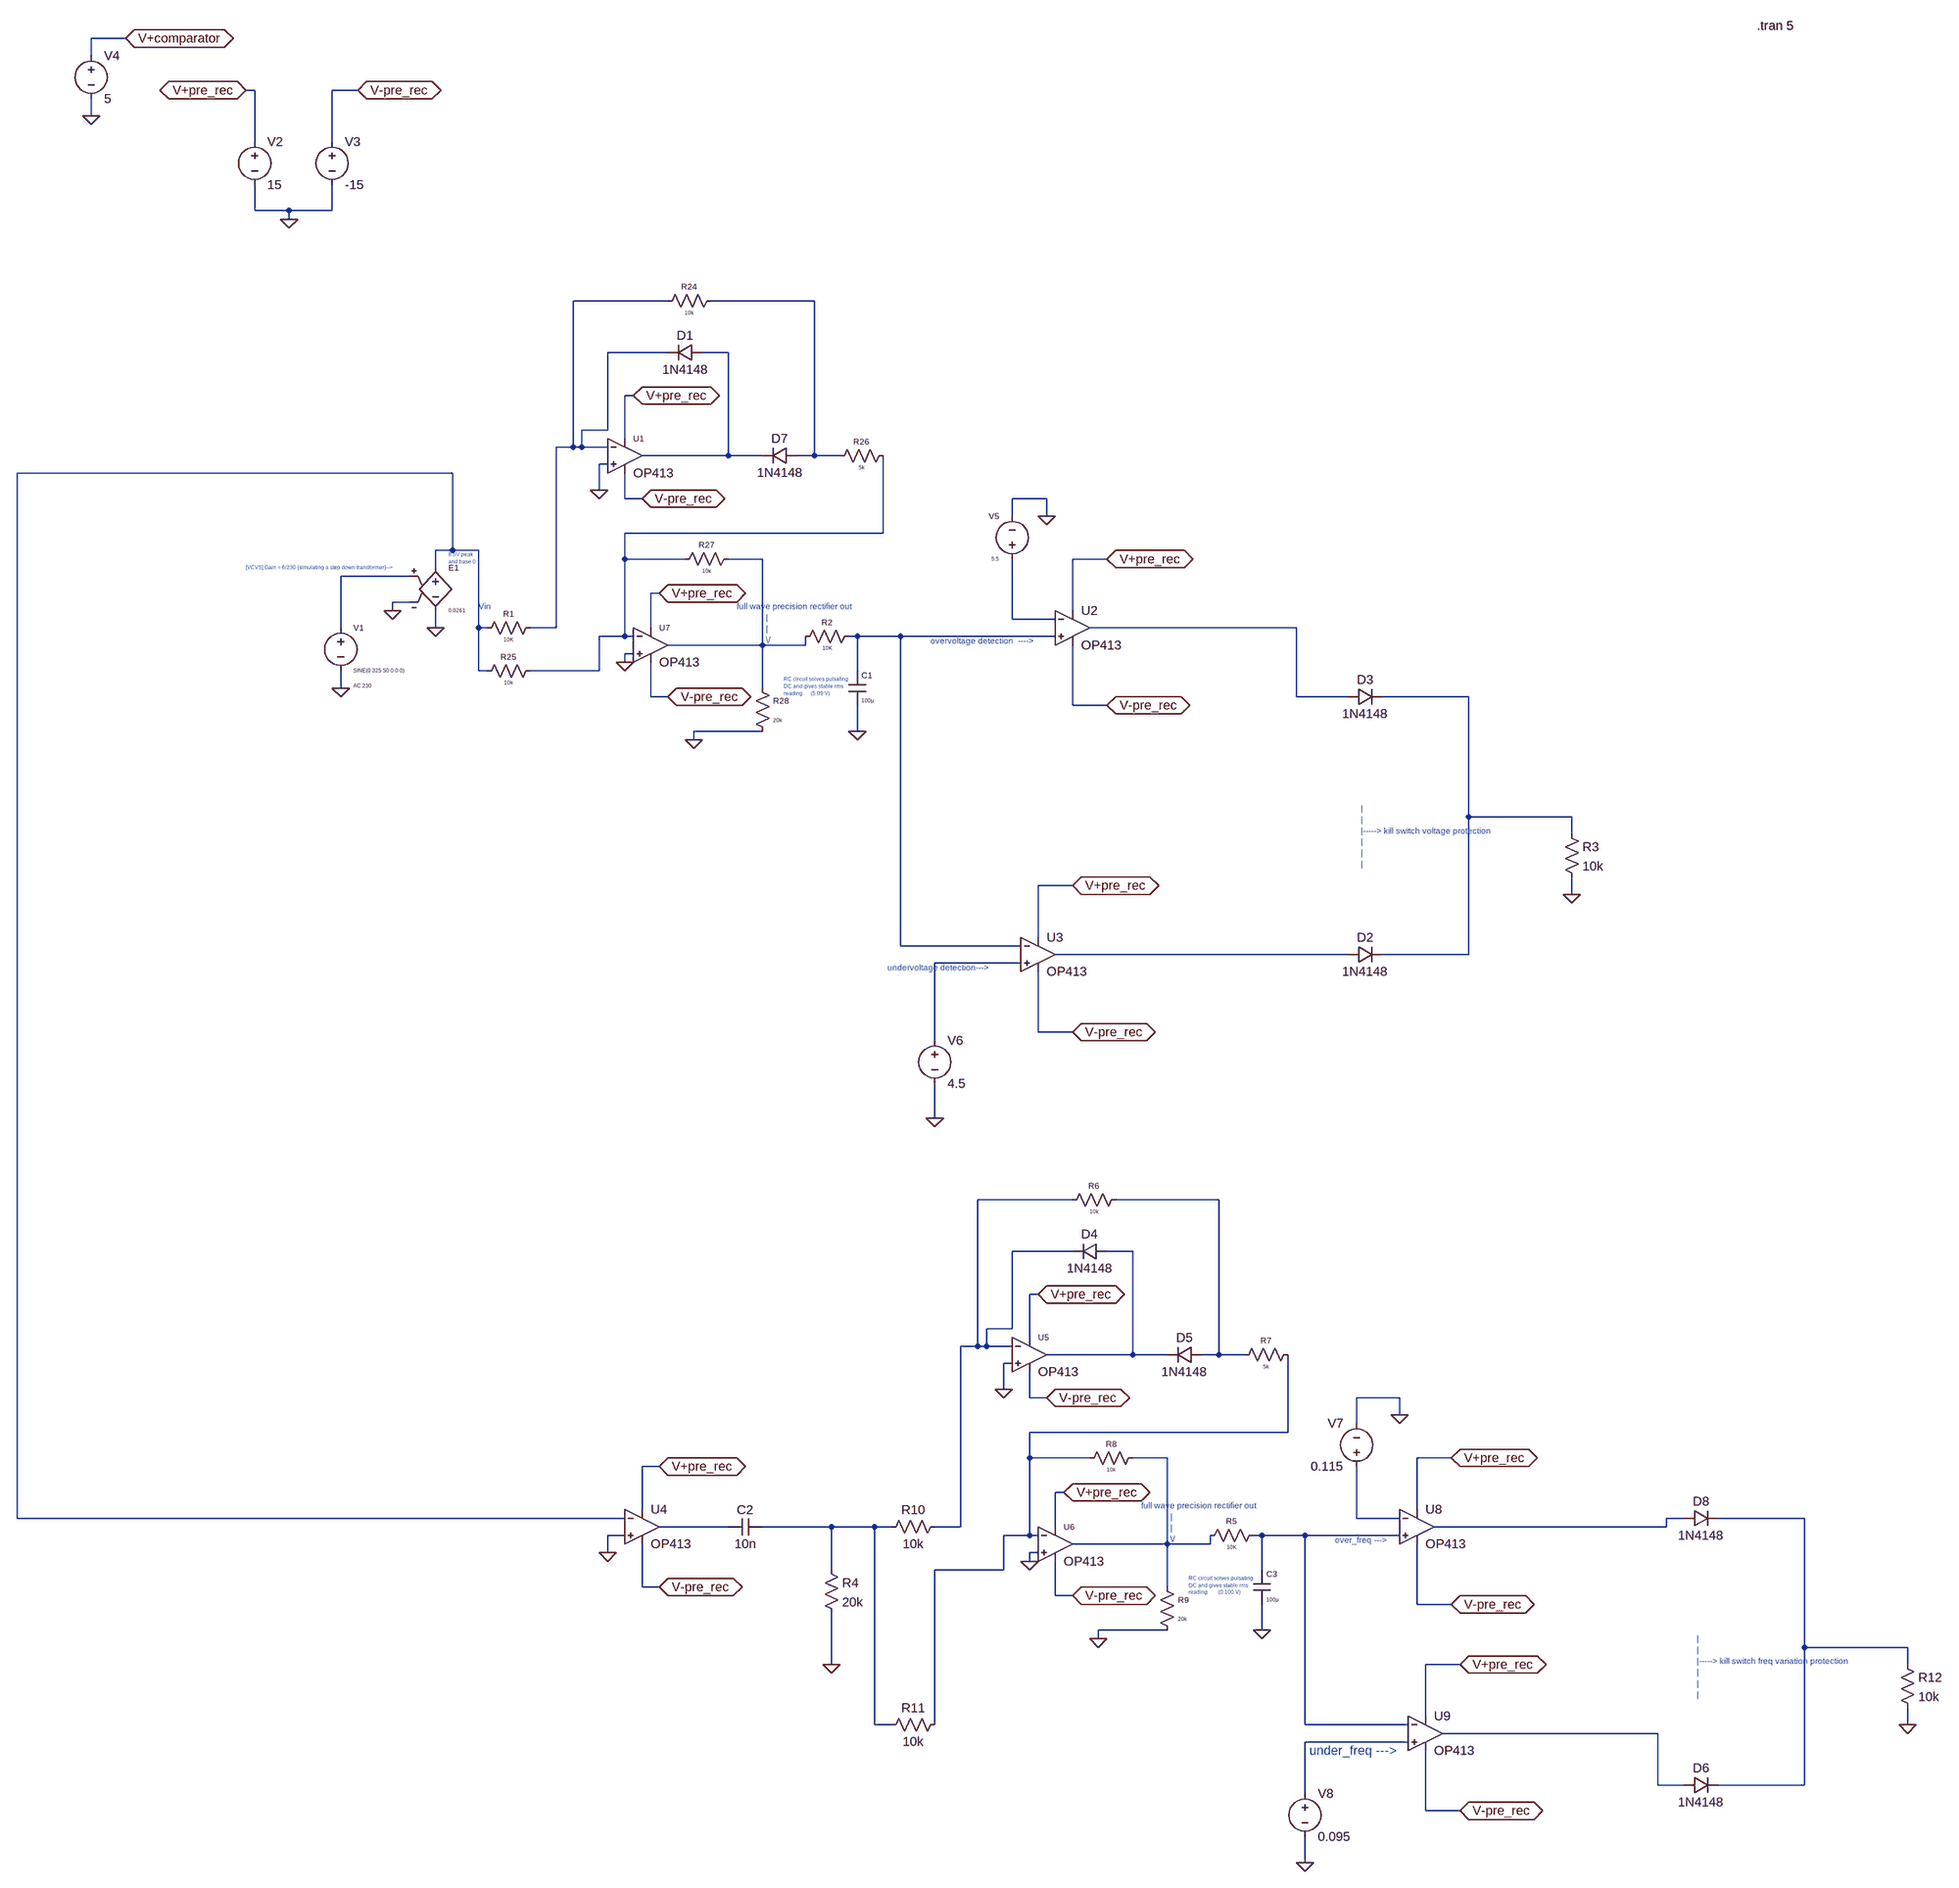
[diagram p0: schematic analog_power_quality_monitor.asc]
analog_power_quality_monitor.asc, the LTspice schematic file:
Version 4.1
SHEET 1 3092 2548
WIRE -416 -1168 -480 -1168
WIRE -480 -1136 -480 -1168
WIRE -176 -1072 -192 -1072
WIRE 16 -1072 -32 -1072
WIRE -480 -1024 -480 -1056
WIRE -176 -976 -176 -1072
WIRE -32 -976 -32 -1072
WIRE -176 -848 -176 -896
WIRE -112 -848 -176 -848
WIRE -32 -848 -32 -896
WIRE -32 -848 -112 -848
WIRE -112 -832 -112 -848
WIRE 592 -672 416 -672
WIRE 864 -672 672 -672
WIRE 592 -576 480 -576
WIRE 704 -576 656 -576
WIRE 528 -496 512 -496
WIRE 480 -432 480 -576
WIRE 480 -432 432 -432
WIRE 512 -416 512 -496
WIRE 416 -400 416 -672
WIRE 416 -400 384 -400
WIRE 432 -400 432 -432
WIRE 432 -400 416 -400
WIRE 480 -400 432 -400
WIRE 704 -384 704 -576
WIRE 704 -384 544 -384
WIRE 768 -384 704 -384
WIRE 864 -384 864 -672
WIRE 864 -384 832 -384
WIRE 912 -384 864 -384
WIRE 480 -368 464 -368
WIRE 192 -352 -784 -352
WIRE 464 -320 464 -368
WIRE 512 -304 512 -352
WIRE 544 -304 512 -304
WIRE 1296 -304 1232 -304
WIRE 1232 -272 1232 -304
WIRE 1296 -272 1296 -304
WIRE 992 -240 992 -384
WIRE 992 -240 512 -240
WIRE 192 -208 192 -352
WIRE 192 -208 160 -208
WIRE 240 -208 192 -208
WIRE 512 -192 512 -240
WIRE 624 -192 512 -192
WIRE 768 -192 704 -192
WIRE 1408 -192 1344 -192
WIRE 160 -176 160 -208
WIRE 112 -160 -16 -160
WIRE 576 -128 560 -128
WIRE 112 -112 80 -112
WIRE 80 -96 80 -112
WIRE 1344 -96 1344 -192
WIRE 1232 -80 1232 -192
WIRE 1312 -80 1232 -80
WIRE -16 -64 -16 -160
WIRE 160 -64 160 -96
WIRE 240 -64 240 -208
WIRE 256 -64 240 -64
WIRE 384 -64 384 -400
WIRE 384 -64 336 -64
WIRE 560 -64 560 -128
WIRE 1760 -64 1376 -64
WIRE 512 -48 512 -192
WIRE 512 -48 464 -48
WIRE 528 -48 512 -48
WIRE 944 -48 928 -48
WIRE 1024 -48 944 -48
WIRE 1312 -48 1024 -48
WIRE 768 -32 768 -192
WIRE 768 -32 592 -32
WIRE 848 -32 848 -48
WIRE 848 -32 768 -32
WIRE 528 -16 512 -16
WIRE 512 0 512 -16
WIRE 240 16 240 -64
WIRE 256 16 240 16
WIRE 464 16 464 -48
WIRE 464 16 336 16
WIRE 944 16 944 -48
WIRE -16 48 -16 16
WIRE 768 48 768 -32
WIRE 560 64 560 0
WIRE 592 64 560 64
WIRE 1760 64 1760 -64
WIRE 1856 64 1760 64
WIRE 2080 64 1920 64
WIRE 1344 80 1344 -32
WIRE 1408 80 1344 80
WIRE 768 128 640 128
WIRE 944 128 944 80
WIRE 640 144 640 128
WIRE 2080 304 2080 64
WIRE 2272 304 2080 304
WIRE 2272 336 2272 304
WIRE 1344 432 1280 432
WIRE 2272 448 2272 416
WIRE 1280 528 1280 432
WIRE 1024 544 1024 -48
WIRE 1248 544 1024 544
WIRE 1856 560 1312 560
WIRE 2080 560 2080 304
WIRE 2080 560 1920 560
WIRE 1248 576 1088 576
WIRE 1280 704 1280 592
WIRE 1344 704 1280 704
WIRE 1088 720 1088 576
WIRE 1088 864 1088 800
WIRE 1344 1296 1168 1296
WIRE 1616 1296 1424 1296
WIRE 1344 1392 1232 1392
WIRE 1456 1392 1408 1392
WIRE 1280 1472 1264 1472
WIRE 1232 1536 1232 1392
WIRE 1232 1536 1184 1536
WIRE 1264 1552 1264 1472
WIRE 1168 1568 1168 1296
WIRE 1168 1568 1136 1568
WIRE 1184 1568 1184 1536
WIRE 1184 1568 1168 1568
WIRE 1232 1568 1184 1568
WIRE 1456 1584 1456 1392
WIRE 1456 1584 1296 1584
WIRE 1520 1584 1456 1584
WIRE 1616 1584 1616 1296
WIRE 1616 1584 1584 1584
WIRE 1664 1584 1616 1584
WIRE 1232 1600 1216 1600
WIRE 1216 1648 1216 1600
WIRE 1264 1664 1264 1616
WIRE 1296 1664 1264 1664
WIRE 1952 1664 1872 1664
WIRE 1952 1696 1952 1664
WIRE 1872 1712 1872 1664
WIRE 1744 1728 1744 1584
WIRE 1744 1728 1264 1728
WIRE 1264 1776 1264 1728
WIRE 1376 1776 1264 1776
WIRE 1520 1776 1456 1776
WIRE 2048 1776 1984 1776
WIRE 576 1792 544 1792
WIRE 1328 1840 1312 1840
WIRE 544 1872 544 1792
WIRE 1984 1872 1984 1776
WIRE -784 1888 -784 -352
WIRE 512 1888 -784 1888
WIRE 1872 1888 1872 1792
WIRE 1952 1888 1872 1888
WIRE 2480 1888 2448 1888
WIRE 2704 1888 2544 1888
WIRE 704 1904 576 1904
WIRE 896 1904 768 1904
WIRE 976 1904 896 1904
WIRE 1008 1904 976 1904
WIRE 1136 1904 1136 1568
WIRE 1136 1904 1088 1904
WIRE 1312 1904 1312 1840
WIRE 2448 1904 2448 1888
WIRE 2448 1904 2016 1904
WIRE 512 1920 480 1920
WIRE 1264 1920 1264 1776
WIRE 1264 1920 1216 1920
WIRE 1280 1920 1264 1920
WIRE 1696 1920 1680 1920
WIRE 1776 1920 1696 1920
WIRE 1952 1920 1776 1920
WIRE 1520 1936 1520 1776
WIRE 1520 1936 1344 1936
WIRE 1600 1936 1600 1920
WIRE 1600 1936 1520 1936
WIRE 480 1952 480 1920
WIRE 1280 1952 1264 1952
WIRE 1264 1968 1264 1952
WIRE 896 1984 896 1904
WIRE 1216 1984 1216 1920
WIRE 1216 1984 1088 1984
WIRE 1696 1984 1696 1920
WIRE 544 2016 544 1936
WIRE 576 2016 544 2016
WIRE 1520 2016 1520 1936
WIRE 1312 2032 1312 1968
WIRE 1344 2032 1312 2032
WIRE 1984 2048 1984 1936
WIRE 2048 2048 1984 2048
WIRE 1520 2096 1392 2096
WIRE 1696 2096 1696 2048
WIRE 1392 2112 1392 2096
WIRE 2704 2128 2704 1888
WIRE 2896 2128 2704 2128
WIRE 896 2160 896 2064
WIRE 2064 2160 2000 2160
WIRE 2896 2160 2896 2128
WIRE 2000 2256 2000 2160
WIRE 976 2272 976 1904
WIRE 1008 2272 976 2272
WIRE 1088 2272 1088 1984
WIRE 1776 2272 1776 1920
WIRE 1968 2272 1776 2272
WIRE 2896 2272 2896 2240
WIRE 2432 2288 2032 2288
WIRE 1968 2304 1776 2304
WIRE 2432 2384 2432 2288
WIRE 2480 2384 2432 2384
WIRE 2704 2384 2704 2128
WIRE 2704 2384 2544 2384
WIRE 1776 2400 1776 2304
WIRE 2000 2432 2000 2320
WIRE 2064 2432 2000 2432
WIRE 1776 2528 1776 2480
FLAG -16 48 0
FLAG 528 -496 V+pre_rec
IOPIN 528 -496 BiDir
FLAG 544 -304 V-pre_rec
IOPIN 544 -304 BiDir
FLAG -192 -1072 V+pre_rec
IOPIN -192 -1072 BiDir
FLAG 16 -1072 V-pre_rec
IOPIN 16 -1072 BiDir
FLAG -112 -832 0
FLAG 944 128 0
FLAG -416 -1168 V+comparator
IOPIN -416 -1168 BiDir
FLAG -480 -1024 0
FLAG 80 -96 0
FLAG 160 -64 0
FLAG 464 -320 0
FLAG 576 -128 V+pre_rec
IOPIN 576 -128 BiDir
FLAG 592 64 V-pre_rec
IOPIN 592 64 BiDir
FLAG 512 0 0
FLAG 640 144 0
FLAG 1296 -272 0
FLAG 1408 80 V-pre_rec
IOPIN 1408 80 BiDir
FLAG 1408 -192 V+pre_rec
IOPIN 1408 -192 BiDir
FLAG 1344 704 V-pre_rec
IOPIN 1344 704 BiDir
FLAG 1344 432 V+pre_rec
IOPIN 1344 432 BiDir
FLAG 1088 864 0
FLAG 2272 448 0
FLAG 480 1952 0
FLAG 576 1792 V+pre_rec
IOPIN 576 1792 BiDir
FLAG 576 2016 V-pre_rec
IOPIN 576 2016 BiDir
FLAG 896 2160 0
FLAG 1280 1472 V+pre_rec
IOPIN 1280 1472 BiDir
FLAG 1296 1664 V-pre_rec
IOPIN 1296 1664 BiDir
FLAG 1696 2096 0
FLAG 1216 1648 0
FLAG 1328 1840 V+pre_rec
IOPIN 1328 1840 BiDir
FLAG 1344 2032 V-pre_rec
IOPIN 1344 2032 BiDir
FLAG 1264 1968 0
FLAG 1392 2112 0
FLAG 2048 2048 V-pre_rec
IOPIN 2048 2048 BiDir
FLAG 2048 1776 V+pre_rec
IOPIN 2048 1776 BiDir
FLAG 1952 1696 0
FLAG 2064 2432 V-pre_rec
IOPIN 2064 2432 BiDir
FLAG 2064 2160 V+pre_rec
IOPIN 2064 2160 BiDir
FLAG 1776 2528 0
FLAG 2896 2272 0
SYMBOL voltage -16 -80 R0
WINDOW 3 24 96 Left 0
WINDOW 123 24 124 Left 0
WINDOW 39 0 0 Left 0
WINDOW 0 24 16 Left 1
SYMATTR Value SINE(0 325 50 0 0 0)
SYMATTR Value2 AC 230
SYMATTR InstName V1
SYMBOL e 160 -192 R0
WINDOW 0 24 16 Left 1
WINDOW 3 24 96 Left 0
SYMATTR InstName E1
SYMATTR Value 0.0261
SYMBOL OpAmps\\OP413 512 -448 R0
WINDOW 0 16 32 Left 1
SYMATTR InstName U1
SYMBOL voltage -176 -992 R0
WINDOW 123 0 0 Left 0
WINDOW 39 0 0 Left 0
SYMATTR InstName V2
SYMATTR Value 15
SYMBOL voltage -32 -992 R0
WINDOW 123 0 0 Left 0
WINDOW 39 0 0 Left 0
SYMATTR InstName V3
SYMATTR Value -15
SYMBOL res 352 -80 R90
WINDOW 0 0 56 VBottom 1
WINDOW 3 32 56 VTop 0
SYMATTR InstName R1
SYMATTR Value 10K
SYMBOL res 832 -32 R270
WINDOW 0 32 56 VTop 1
WINDOW 3 0 56 VBottom 0
SYMATTR InstName R2
SYMATTR Value 10K
SYMBOL cap 928 16 R0
WINDOW 0 24 8 Left 1
WINDOW 3 24 56 Left 0
SYMATTR InstName C1
SYMATTR Value 100µ
SYMBOL voltage -480 -1152 R0
SYMATTR InstName V4
SYMATTR Value 5
SYMBOL OpAmps\\OP413 560 -96 R0
WINDOW 0 16 32 Left 1
SYMATTR InstName U7
SYMBOL res 352 0 R90
WINDOW 0 0 56 VBottom 1
WINDOW 3 32 56 VTop 0
SYMATTR InstName R25
SYMATTR Value 10k
SYMBOL res 688 -688 R90
WINDOW 0 0 56 VBottom 1
WINDOW 3 32 56 VTop 0
SYMATTR InstName R24
SYMATTR Value 10k
SYMBOL diode 656 -592 R90
WINDOW 0 0 32 VBottom 2
WINDOW 3 32 32 VTop 2
SYMATTR InstName D1
SYMATTR Value 1N4148
SYMBOL diode 832 -400 R90
WINDOW 0 0 32 VBottom 2
WINDOW 3 32 32 VTop 2
SYMATTR InstName D7
SYMATTR Value 1N4148
SYMBOL res 1008 -400 R90
WINDOW 0 0 56 VBottom 1
WINDOW 3 32 56 VTop 0
SYMATTR InstName R26
SYMATTR Value 5k
SYMBOL res 720 -208 R90
WINDOW 0 0 56 VBottom 1
WINDOW 3 32 56 VTop 0
SYMATTR InstName R27
SYMATTR Value 10k
SYMBOL res 752 32 R0
WINDOW 0 36 40 Left 1
WINDOW 3 36 76 Left 0
SYMATTR InstName R28
SYMATTR Value 20k
SYMBOL voltage 1232 -176 R180
WINDOW 0 24 96 Left 1
WINDOW 3 24 16 Left 0
SYMATTR InstName V5
SYMATTR Value 5.5
SYMBOL OpAmps\\OP413 1344 -128 R0
SYMATTR InstName U2
SYMBOL OpAmps\\OP413 1280 496 R0
SYMATTR InstName U3
SYMBOL voltage 1088 704 R0
WINDOW 123 0 0 Left 0
WINDOW 39 0 0 Left 0
SYMATTR InstName V6
SYMATTR Value 4.5
SYMBOL diode 1856 576 R270
WINDOW 0 32 32 VTop 2
WINDOW 3 0 32 VBottom 2
SYMATTR InstName D2
SYMATTR Value 1N4148
SYMBOL diode 1856 80 R270
WINDOW 0 32 32 VTop 2
WINDOW 3 0 32 VBottom 2
SYMATTR InstName D3
SYMATTR Value 1N4148
SYMBOL res 2256 320 R0
SYMATTR InstName R3
SYMATTR Value 10k
SYMBOL OpAmps\\OP413 544 1840 R0
SYMATTR InstName U4
SYMBOL cap 768 1888 R90
WINDOW 0 0 32 VBottom 2
WINDOW 3 32 32 VTop 2
SYMATTR InstName C2
SYMATTR Value 10n
SYMBOL res 880 1968 R0
SYMATTR InstName R4
SYMATTR Value 20k
SYMBOL OpAmps\\OP413 1264 1520 R0
WINDOW 0 16 32 Left 1
SYMATTR InstName U5
SYMBOL res 1584 1936 R270
WINDOW 0 32 56 VTop 1
WINDOW 3 0 56 VBottom 0
SYMATTR InstName R5
SYMATTR Value 10K
SYMBOL cap 1680 1984 R0
WINDOW 0 24 8 Left 1
WINDOW 3 24 56 Left 0
SYMATTR InstName C3
SYMATTR Value 100µ
SYMBOL OpAmps\\OP413 1312 1872 R0
WINDOW 0 16 32 Left 1
SYMATTR InstName U6
SYMBOL res 1440 1280 R90
WINDOW 0 0 56 VBottom 1
WINDOW 3 32 56 VTop 0
SYMATTR InstName R6
SYMATTR Value 10k
SYMBOL diode 1408 1376 R90
WINDOW 0 0 32 VBottom 2
WINDOW 3 32 32 VTop 2
SYMATTR InstName D4
SYMATTR Value 1N4148
SYMBOL diode 1584 1568 R90
WINDOW 0 0 32 VBottom 2
WINDOW 3 32 32 VTop 2
SYMATTR InstName D5
SYMATTR Value 1N4148
SYMBOL res 1760 1568 R90
WINDOW 0 0 56 VBottom 1
WINDOW 3 32 56 VTop 0
SYMATTR InstName R7
SYMATTR Value 5k
SYMBOL res 1472 1760 R90
WINDOW 0 0 56 VBottom 1
WINDOW 3 32 56 VTop 0
SYMATTR InstName R8
SYMATTR Value 10k
SYMBOL res 1504 2000 R0
WINDOW 0 36 40 Left 1
WINDOW 3 36 76 Left 0
SYMATTR InstName R9
SYMATTR Value 20k
SYMBOL res 1104 1888 R90
WINDOW 0 0 56 VBottom 2
WINDOW 3 32 56 VTop 2
SYMATTR InstName R10
SYMATTR Value 10k
SYMBOL res 1104 2256 R90
WINDOW 0 0 56 VBottom 2
WINDOW 3 32 56 VTop 2
SYMATTR InstName R11
SYMATTR Value 10k
SYMBOL OpAmps\\OP413 1984 1840 R0
SYMATTR InstName U8
SYMBOL voltage 1872 1808 R180
WINDOW 0 24 96 Left 2
WINDOW 3 24 16 Left 2
WINDOW 123 0 0 Left 0
WINDOW 39 0 0 Left 0
SYMATTR InstName V7
SYMATTR Value 0.115
SYMBOL OpAmps\\OP413 2000 2224 R0
SYMATTR InstName U9
SYMBOL voltage 1776 2384 R0
SYMATTR InstName V8
SYMATTR Value 0.095
SYMBOL diode 2480 2400 R270
WINDOW 0 32 32 VTop 2
WINDOW 3 0 32 VBottom 2
SYMATTR InstName D6
SYMATTR Value 1N4148
SYMBOL diode 2480 1904 R270
WINDOW 0 32 32 VTop 2
WINDOW 3 0 32 VBottom 2
SYMATTR InstName D8
SYMATTR Value 1N4148
SYMBOL res 2880 2144 R0
SYMATTR InstName R12
SYMATTR Value 10k
TEXT -192 -176 Left 0 ;[VCVS] Gain = 6/230 {simulating a step down transformer}-->
TEXT 808 32 Left 0 ;RC circuit solves pulsating \nDC and gives stable rms\nreading      (5.09 V)
TEXT 2616 -1192 Left 2 !.tran 5
TEXT 184 -200 Left 0 ;8.5V peak\nand base 0
TEXT 240 -104 Left 1 ;Vin
TEXT 720 -104 Left 1 ;full wave precision rectifier out \n             |\n             |\n             \\/
TEXT 1080 -40 Left 1 ;overvoltage detection  ---->
TEXT 1000 584 Left 1 ;undervoltage detection--->
TEXT 1880 288 Left 1 ;|\n|\n|-----> kill switch voltage protection\n|\n|\n|
TEXT 1560 2000 Left 0 ;RC circuit solves pulsating \nDC and gives stable rms\nreading        (0.100 V)
TEXT 1472 1864 Left 1 ;full wave precision rectifier out \n             |\n             |\n             \\/
TEXT 1832 1928 Left 1 ;over_freq --->
TEXT 1784 2320 Left 2 ;under_freq --->
TEXT 2504 2112 Left 1 ;|\n|\n|-----> kill switch freq variation protection\n|\n|\n|

The netlist it stands for:
* analog_power_quality_monitor.asc
V1 N007 0 SINE(0 325 50 0 0 0) AC 230
E1 N004 0 N007 0 0.0261
X§U1 0 N001 V+pre_rec V-pre_rec N003 OP413  ; pins In+ In- V+ V- OUT
V2 V+pre_rec 0 15
V3 V-pre_rec 0 -15
R1 N001 N004 10K
R2 N006 N010 10K
C1 N010 0 100µ
V4 V+comparator 0 5
X§U7 0 N005 V+pre_rec V-pre_rec N006 OP413  ; pins In+ In- V+ V- OUT
R25 N005 N004 10k
R24 N002 N001 10k
D1 N003 N001 1N4148
D7 N002 N003 1N4148
R26 N005 N002 5k
R27 N006 N005 10k
R28 N006 0 20k
V5 N008 0 5.5
X§U2 N010 N008 V+pre_rec V-pre_rec N009 OP413  ; pins In+ In- V+ V- OUT
X§U3 N013 N010 V+pre_rec V-pre_rec N012 OP413  ; pins In+ In- V+ V- OUT
V6 N013 0 4.5
D2 N012 N011 1N4148
D3 N009 N011 1N4148
R3 N011 0 10k
X§U4 0 N004 V+pre_rec V-pre_rec N022 OP413  ; pins In+ In- V+ V- OUT
C2 N023 N022 10n
R4 N023 0 20k
X§U5 0 N014 V+pre_rec V-pre_rec N016 OP413  ; pins In+ In- V+ V- OUT
R5 N018 N024 10K
C3 N024 0 100µ
X§U6 0 N017 V+pre_rec V-pre_rec N018 OP413  ; pins In+ In- V+ V- OUT
R6 N015 N014 10k
D4 N016 N014 1N4148
D5 N015 N016 1N4148
R7 N017 N015 5k
R8 N018 N017 10k
R9 N018 0 20k
R10 N014 N023 10k
R11 N017 N023 10k
X§U8 N024 N019 V+pre_rec V-pre_rec N020 OP413  ; pins In+ In- V+ V- OUT
V7 N019 0 0.115
X§U9 N026 N024 V+pre_rec V-pre_rec N025 OP413  ; pins In+ In- V+ V- OUT
V8 N026 0 0.095
D6 N025 N021 1N4148
D8 N020 N021 1N4148
R12 N021 0 10k
.model D D
.lib standard.dio
* [VCVS] Gain = 6/230 {simulating a step down transformer}-->
* RC circuit solves pulsating
* DC and gives stable rms
* reading      (5.09 V)
.tran 5
* 8.5V peak
* and base 0
* Vin
* full wave precision rectifier out
*              |
*              |
*              \/
* overvoltage detection  ---->
* undervoltage detection--->
* |
* |
* |-----> kill switch voltage protection
* |
* |
* |
* RC circuit solves pulsating
* DC and gives stable rms
* reading        (0.100 V)
* full wave precision rectifier out
*              |
*              |
*              \/
* over_freq --->
* under_freq --->
* |
* |
* |-----> kill switch freq variation protection
* |
* |
* |
.backanno
.end